# Altium schematic sheet SpaceDisplayButtonBoard_SCH.SchDoc
size B; SheetNumber: 1; SheetTotal: 1
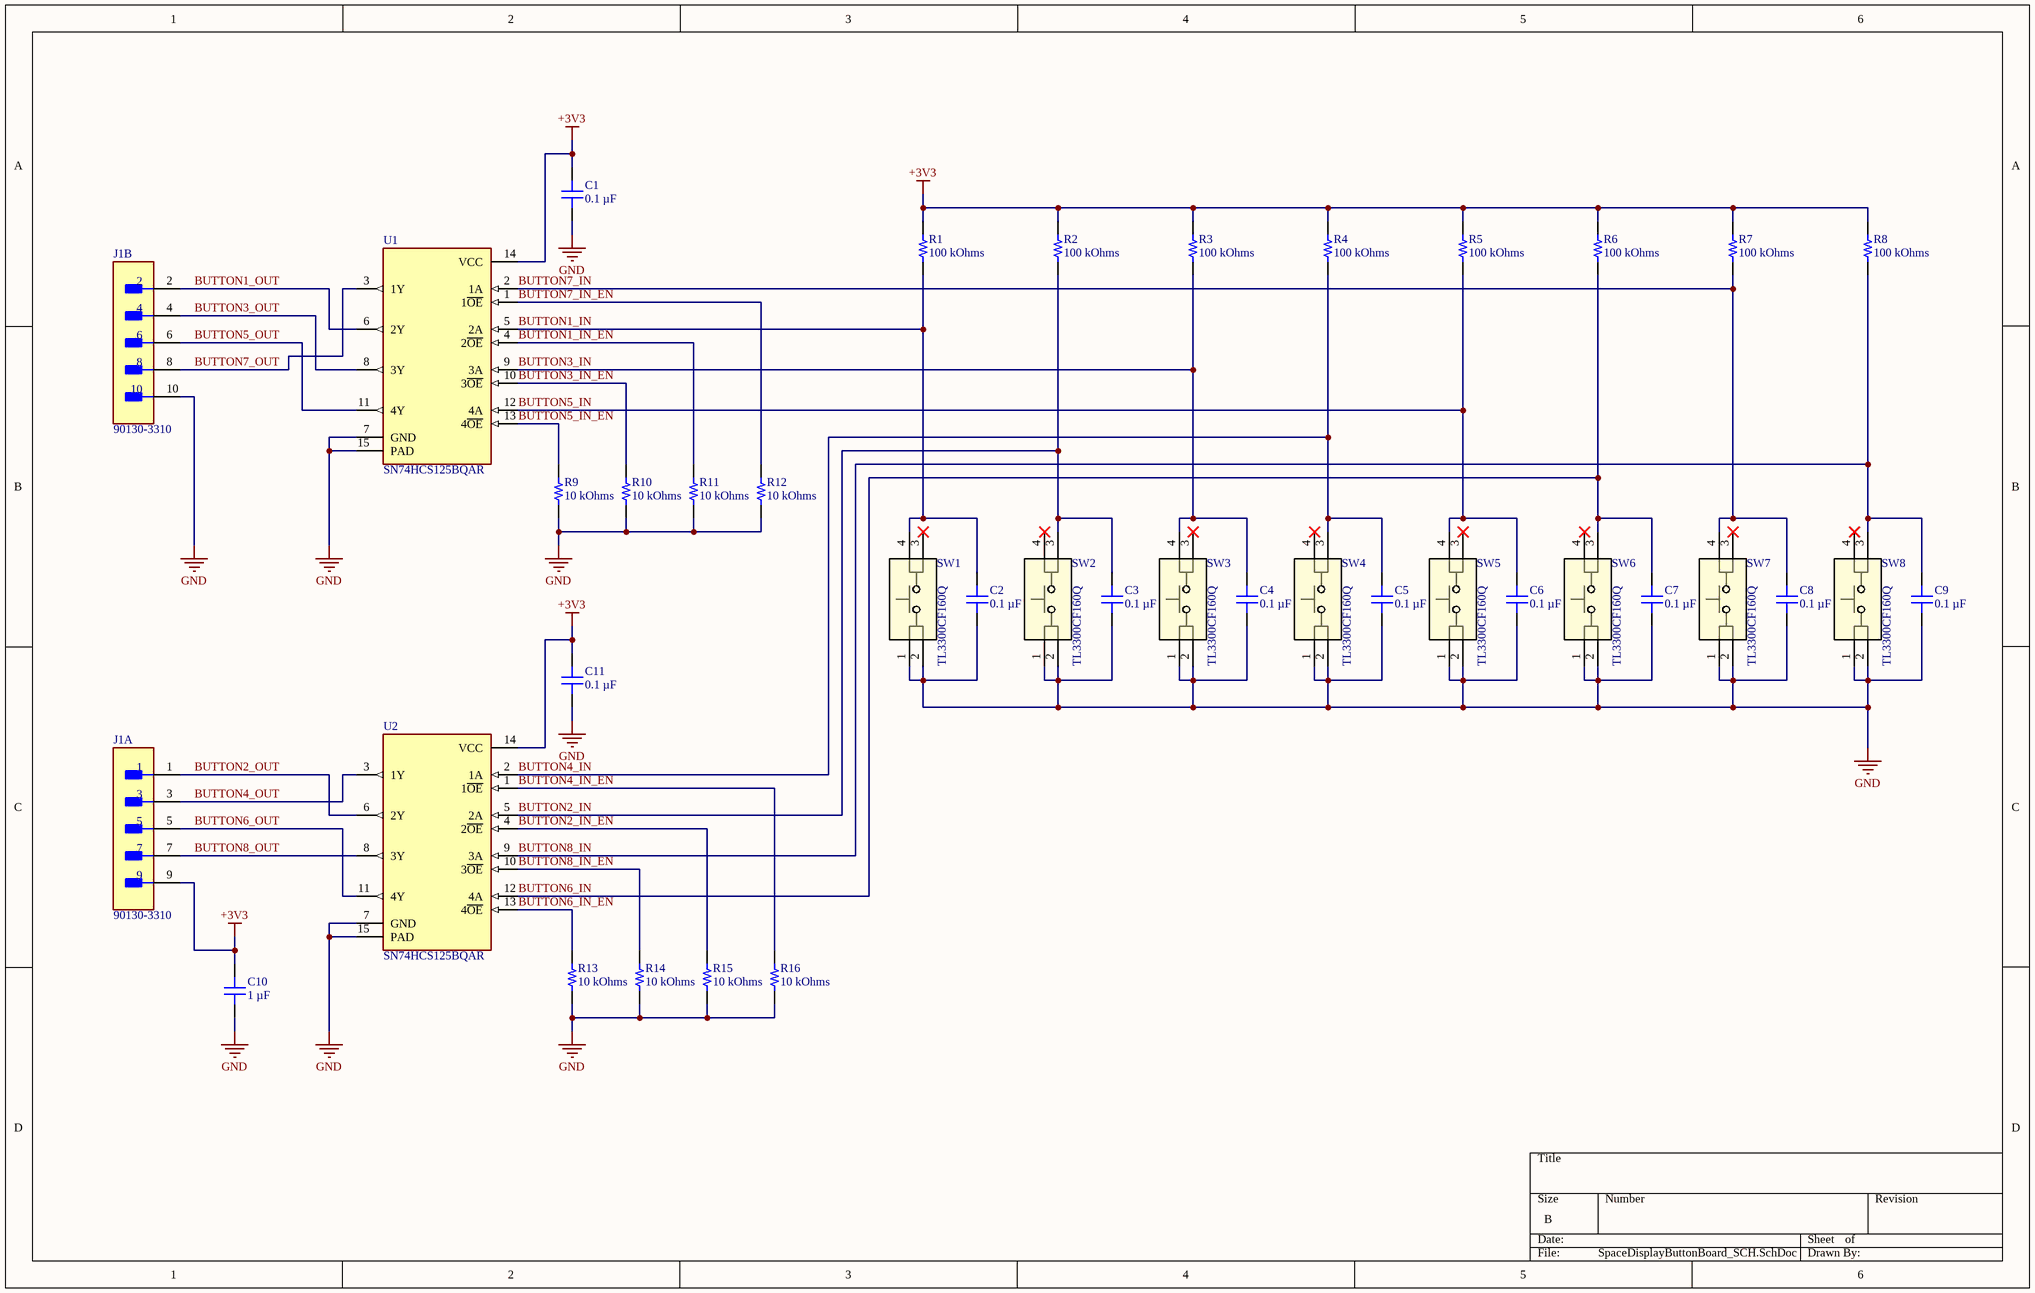
[diagram p0: SpaceDisplayButtonBoard_SCH.SchDoc]

## Parts
C1  0.1 µF  [CAP 0603_1608]
C2  0.1 µF  [CAP 0603_1608]
C3  0.1 µF  [CAP 0603_1608]
C4  0.1 µF  [CAP 0603_1608]
C5  0.1 µF  [CAP 0603_1608]
C6  0.1 µF  [CAP 0603_1608]
C7  0.1 µF  [CAP 0603_1608]
C8  0.1 µF  [CAP 0603_1608]
C9  0.1 µF  [CAP 0603_1608]
C10  1 µF  [CAP 0603_1608]
C11  0.1 µF  [CAP 0603_1608]
J1  90130-3310  [FP-90130-3310-MFG]  (parts A,B of 2)
R1  100 kOhms  [RES 0603_1608]
R2  100 kOhms  [RES 0603_1608]
R3  100 kOhms  [RES 0603_1608]
R4  100 kOhms  [RES 0603_1608]
R5  100 kOhms  [RES 0603_1608]
R6  100 kOhms  [RES 0603_1608]
R7  100 kOhms  [RES 0603_1608]
R8  100 kOhms  [RES 0603_1608]
R9  10 kOhms  [RES 0603_1608]
R10  10 kOhms  [RES 0603_1608]
R11  10 kOhms  [RES 0603_1608]
R12  10 kOhms  [RES 0603_1608]
R13  10 kOhms  [RES 0603_1608]
R14  10 kOhms  [RES 0603_1608]
R15  10 kOhms  [RES 0603_1608]
R16  10 kOhms  [RES 0603_1608]
SW1  TL3300CF160Q  [SW_TL3300CF160Q_EWI]
SW2  TL3300CF160Q  [SW_TL3300CF160Q_EWI]
SW3  TL3300CF160Q  [SW_TL3300CF160Q_EWI]
SW4  TL3300CF160Q  [SW_TL3300CF160Q_EWI]
SW5  TL3300CF160Q  [SW_TL3300CF160Q_EWI]
SW6  TL3300CF160Q  [SW_TL3300CF160Q_EWI]
SW7  TL3300CF160Q  [SW_TL3300CF160Q_EWI]
SW8  TL3300CF160Q  [SW_TL3300CF160Q_EWI]
U1  SN74HCS125BQAR  [FP-BQA0014A-MFG]
U2  SN74HCS125BQAR  [FP-BQA0014A-MFG]

## Nets
+3V3: C1.2 C10.2 C11.2 J1.9 R1.2 R2.2 R3.2 R4.2 R5.2 R6.2 R7.2 R8.2 U1.14(VCC) U2.14(VCC)
GND: C1.1 C2.1 C3.1 C4.1 C5.1 C6.1 C7.1 C8.1 C9.1 C10.1 C11.1 J1.10 R9.1 R10.1 R11.1 R12.1 R13.1 R14.1 R15.1 R16.1 SW1.1 SW1.2 SW2.1 SW2.2 SW3.1 SW3.2 SW4.1 SW4.2 SW5.1 SW5.2 SW6.1 SW6.2 SW7.1 SW7.2 SW8.1 SW8.2 U1.7(GND) U1.15(PAD) U2.7(GND) U2.15(PAD)
BUTTON1_IN: C2.2 R1.1 SW1.4 U1.5(2A)
BUTTON1_IN_EN: R11.2 U1.4(2~{OE})
BUTTON1_OUT: J1.2 U1.6(2Y)
BUTTON2_IN: C3.2 R2.1 SW2.3 U2.5(2A)
BUTTON2_IN_EN: R15.2 U2.4(2~{OE})
BUTTON2_OUT: J1.1 U2.6(2Y)
BUTTON3_IN: C4.2 R3.1 SW3.4 U1.9(3A)
BUTTON3_IN_EN: R10.2 U1.10(3~{OE})
BUTTON3_OUT: J1.4 U1.8(3Y)
BUTTON4_IN: C5.2 R4.1 SW4.3 U2.2(1A)
BUTTON4_IN_EN: R16.2 U2.1(1~{OE})
BUTTON4_OUT: J1.3 U2.3(1Y)
BUTTON5_IN: C6.2 R5.1 SW5.4 U1.12(4A)
BUTTON5_IN_EN: R9.2 U1.13(4~{OE})
BUTTON5_OUT: J1.6 U1.11(4Y)
BUTTON6_IN: C7.2 R6.1 SW6.3 U2.12(4A)
BUTTON6_IN_EN: R13.2 U2.13(4~{OE})
BUTTON6_OUT: J1.5 U2.11(4Y)
BUTTON7_IN: C8.2 R7.1 SW7.4 U1.2(1A)
BUTTON7_IN_EN: R12.2 U1.1(1~{OE})
BUTTON7_OUT: J1.8 U1.3(1Y)
BUTTON8_IN: C9.2 R8.1 SW8.3 U2.9(3A)
BUTTON8_IN_EN: R14.2 U2.10(3~{OE})
BUTTON8_OUT: J1.7 U2.8(3Y)

Not connected (* = marked no-connect by the designer): SW1 3*; SW2 4*; SW3 3*; SW4 4*; SW5 3*; SW6 4*; SW7 3*; SW8 4*

## Library data of the parts
C1-C9 C11 = CL10B104KA8WPNC: CAP CER 0.1UF 25V X7R 0603; manufacturer: Samsung Electro-Mechanics; Tolerance: ±10%; Part Number: CL10B104KA8WPNC; Capacitance: 0.1 µF; Applications: Automotive; componentlink1description: Datasheet; componentlink1url: http://www.samsungsem.com/kr/support/product-search/mlcc/CL10B104KA8WPNC.jsp; componentlink2description: DigiKey Link; componentlink2url: https://www.digikey.com/en/products/detail/samsung-electro-mechanics/CL10B104KA8WPNC/5961201; Device Package: 0603 (1608 Metric); Features: Open Mode; lastupdated: 2/9/2024 8:10:26 PM; Lifecycle Status: Active; Minimum Order: 1; Mounting Type: Surface Mount, MLCC; Operating Temperature: -55°C ~ 125°C; Package / Case: 0603 (1608 Metric); packaging: TapeAndReel; partid: 5631; Part Status: Active; price: 0.01; Ratings: AEC-Q200; series: CL; Size / Dimension: 0.063" L x 0.031" W (1.60mm x 0.80mm); Supplier 1: DigiKey; Supplier Part Number 1: 1276-6717-1-ND; Temperature Coefficient: X7R; Thickness (Max): 0.035" (0.90mm); value: 0.1 µF; Voltage - Rated: 25V
C10 = CL10A105KA8NNNC: CAP CER 1UF 25V X5R 0603; manufacturer: Samsung Electro-Mechanics; Tolerance: ±10%; Part Number: CL10A105KA8NNNC; Capacitance: 1 µF; Applications: General Purpose; componentlink1description: Datasheet; componentlink1url: http://www.samsungsem.com/kr/support/product-search/mlcc/CL10A105KA8NNNC.jsp; componentlink2description: DigiKey Link; componentlink2url: https://www.digikey.com/en/products/detail/samsung-electro-mechanics/CL10A105KA8NNNC/3886760; Device Package: 0603 (1608 Metric); lastupdated: 2/9/2024 8:10:26 PM; Lifecycle Status: Active; Minimum Order: 1; Mounting Type: Surface Mount, MLCC; Operating Temperature: -55°C ~ 85°C; Package / Case: 0603 (1608 Metric); packaging: TapeAndReel; partid: 5508; Part Status: Active; price: 0.01; series: CL; Size / Dimension: 0.063" L x 0.031" W (1.60mm x 0.80mm); Supplier 1: DigiKey; Supplier Part Number 1: 1276-1102-1-ND; Temperature Coefficient: X5R; Thickness (Max): 0.035" (0.90mm); value: 1 µF; Voltage - Rated: 25V
J1 = CMP-00257-07135077-1: 90130-3310 Conn Shrouded Header (4 Sides) HDR 10 POS 2.54mm Solder RA Thru-Hole C-Grid III™ Frame; Manufacturer Lifecycle Status: ACTIVE; Glow Wire Compliant: Non-compliant; Voltage Rating (DC): 350V; Number of Circuits: 8; Max Voltage Rating (DC): 350.35kV; Current Rating: 3A; Number of Contacts: 10; Plating: Tin; Lead Pitch: 2.54mm; Pitch: 2.54mm; Contact Plating: Gold; Contact Material: Brass; Lifecycle Status: Production; Number of Rows: 2; Country of Origin: SK; RoHS: Compliant; Termination: Solder; Color: Black; Max Operating Temperature: 125°C; Voltage Rating (AC): 350V; Height: 10.05mm; Orientation: Right Angle; Mount: Through Hole; Voltage Rating: 350V; Number of Positions: 10; Min Operating Temperature: -55°C; NexarPartId: 7135077; Housing Material: Polyester
R1-R8 = RMCF0603FT100K: RES 100K OHM 1% 1/10W 0603; Manufacturer: Stackpole Electronics Inc; Power (Watts): 0.1W, 1/10W; Temperature Coefficient: ±100ppm/°C; Part Number: RMCF0603FT100K; Value: 100 kOhms; ComponentLink1Description: Datasheet; ComponentLink1URL: https://www.seielect.com/catalog/sei-packaging.pdf; ComponentLink2Description: DigiKey Link; ComponentLink2URL: https://www.digikey.com/en/products/detail/stackpole-electronics-inc/RMCF0603FT100K/1761112; Composition: Thick Film; Device Package: 0603 (1608 Metric); Features: Automotive AEC-Q200; Height - Seated (Max): 0.022" (0.55mm); LastUpdated: 2/9/2024 8:42:00 PM; Lifecycle Status: Active; Minimum Order: 1; Number of Terminations: 2; Operating Temperature: -55°C ~ 155°C; Package / Case: 0603 (1608 Metric); Packaging: CutTape; PartId: 25664; Part Status: Active; Price: 0.01; Ratings: AEC-Q200; Resistance: 100 kOhms; Series: RMCF; Size / Dimension: 0.061" L x 0.031" W (1.55mm x 0.80mm); Supplier 1: DigiKey; Supplier Part Number 1: RMCF0603FT100KCT-ND; Supplier Device Package: 0603; Tolerance: ±1%
R9-R16 = RMCF0603FT10K0: RES 10K OHM 1% 1/10W 0603; Manufacturer: Stackpole Electronics Inc; Power (Watts): 0.1W, 1/10W; Temperature Coefficient: ±100ppm/°C; Part Number: RMCF0603FT10K0; Value: 10 kOhms; ComponentLink1Description: Datasheet; ComponentLink1URL: https://www.seielect.com/catalog/sei-rmcf_rmcp.pdf; ComponentLink2Description: DigiKey Link; ComponentLink2URL: https://www.digikey.com/en/products/detail/stackpole-electronics-inc/RMCF0603FT10K0/1761235; Composition: Thick Film; Device Package: 0603 (1608 Metric); Features: Automotive AEC-Q200; Height - Seated (Max): 0.022" (0.55mm); LastUpdated: 2/9/2024 8:42:00 PM; Lifecycle Status: Active; Minimum Order: 1; Number of Terminations: 2; Operating Temperature: -55°C ~ 155°C; Package / Case: 0603 (1608 Metric); Packaging: CutTape; PartId: 25663; Part Status: Active; Price: 0.01; Ratings: AEC-Q200; Resistance: 10 kOhms; Series: RMCF; Size / Dimension: 0.061" L x 0.031" W (1.55mm x 0.80mm); Supplier 1: DigiKey; Supplier Part Number 1: RMCF0603FT10K0CT-ND; Supplier Device Package: 0603; Tolerance: ±1%
SW1-SW8 = TL3300CF160Q: Description; Manufacturer_Name: E-Switch; Copyright: Copyright (C) 2025 Ultra Librarian. All rights reserved.; Manufacturer_Part_Number: TL3300CF160Q; RefDes: RefDes; Type: Type; Supplier 1: Digikey; Supplier Part Number 1: EG4904CT-ND
U1 U2 = CMP-04900-000043-1: IC BUFFER NON-INVERT 6V 14WQFN